# Altium project TMDX654GPEVM.PrjPcb (part 19 of 24)

## Sheet 40-PRE_REG AND SERDES POWER SUPPLY.SchDoc
size 513 x 386 mm
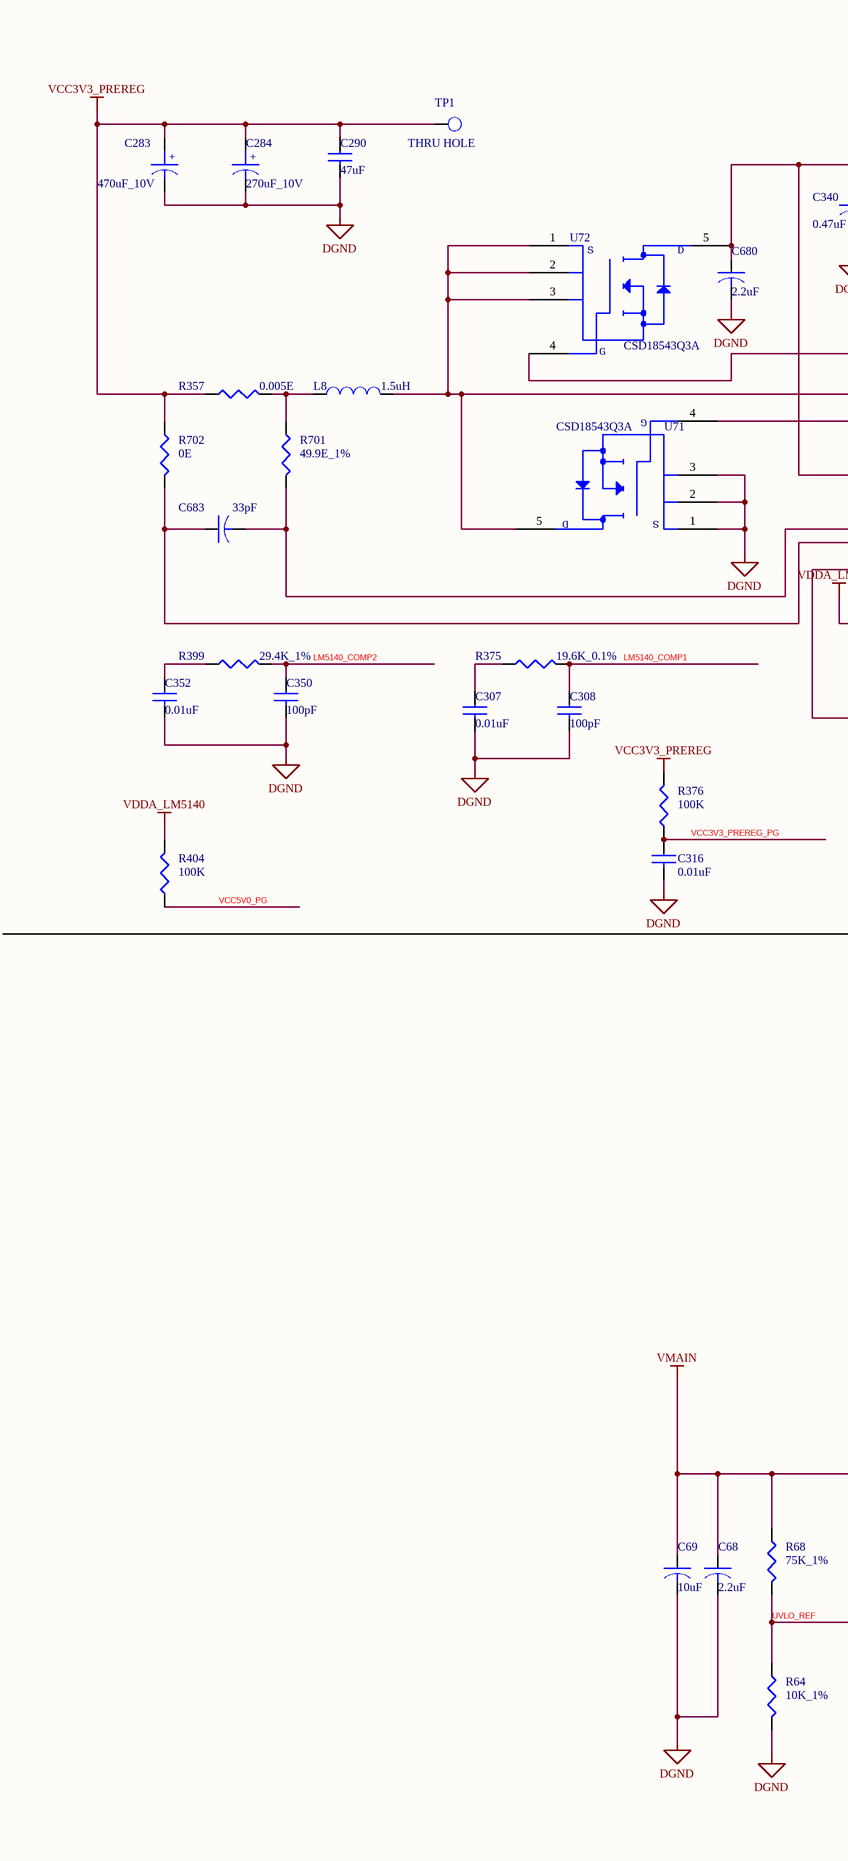
[diagram p74: 40-PRE_REG AND SERDES POWER SUPPLY.SchDoc, left]
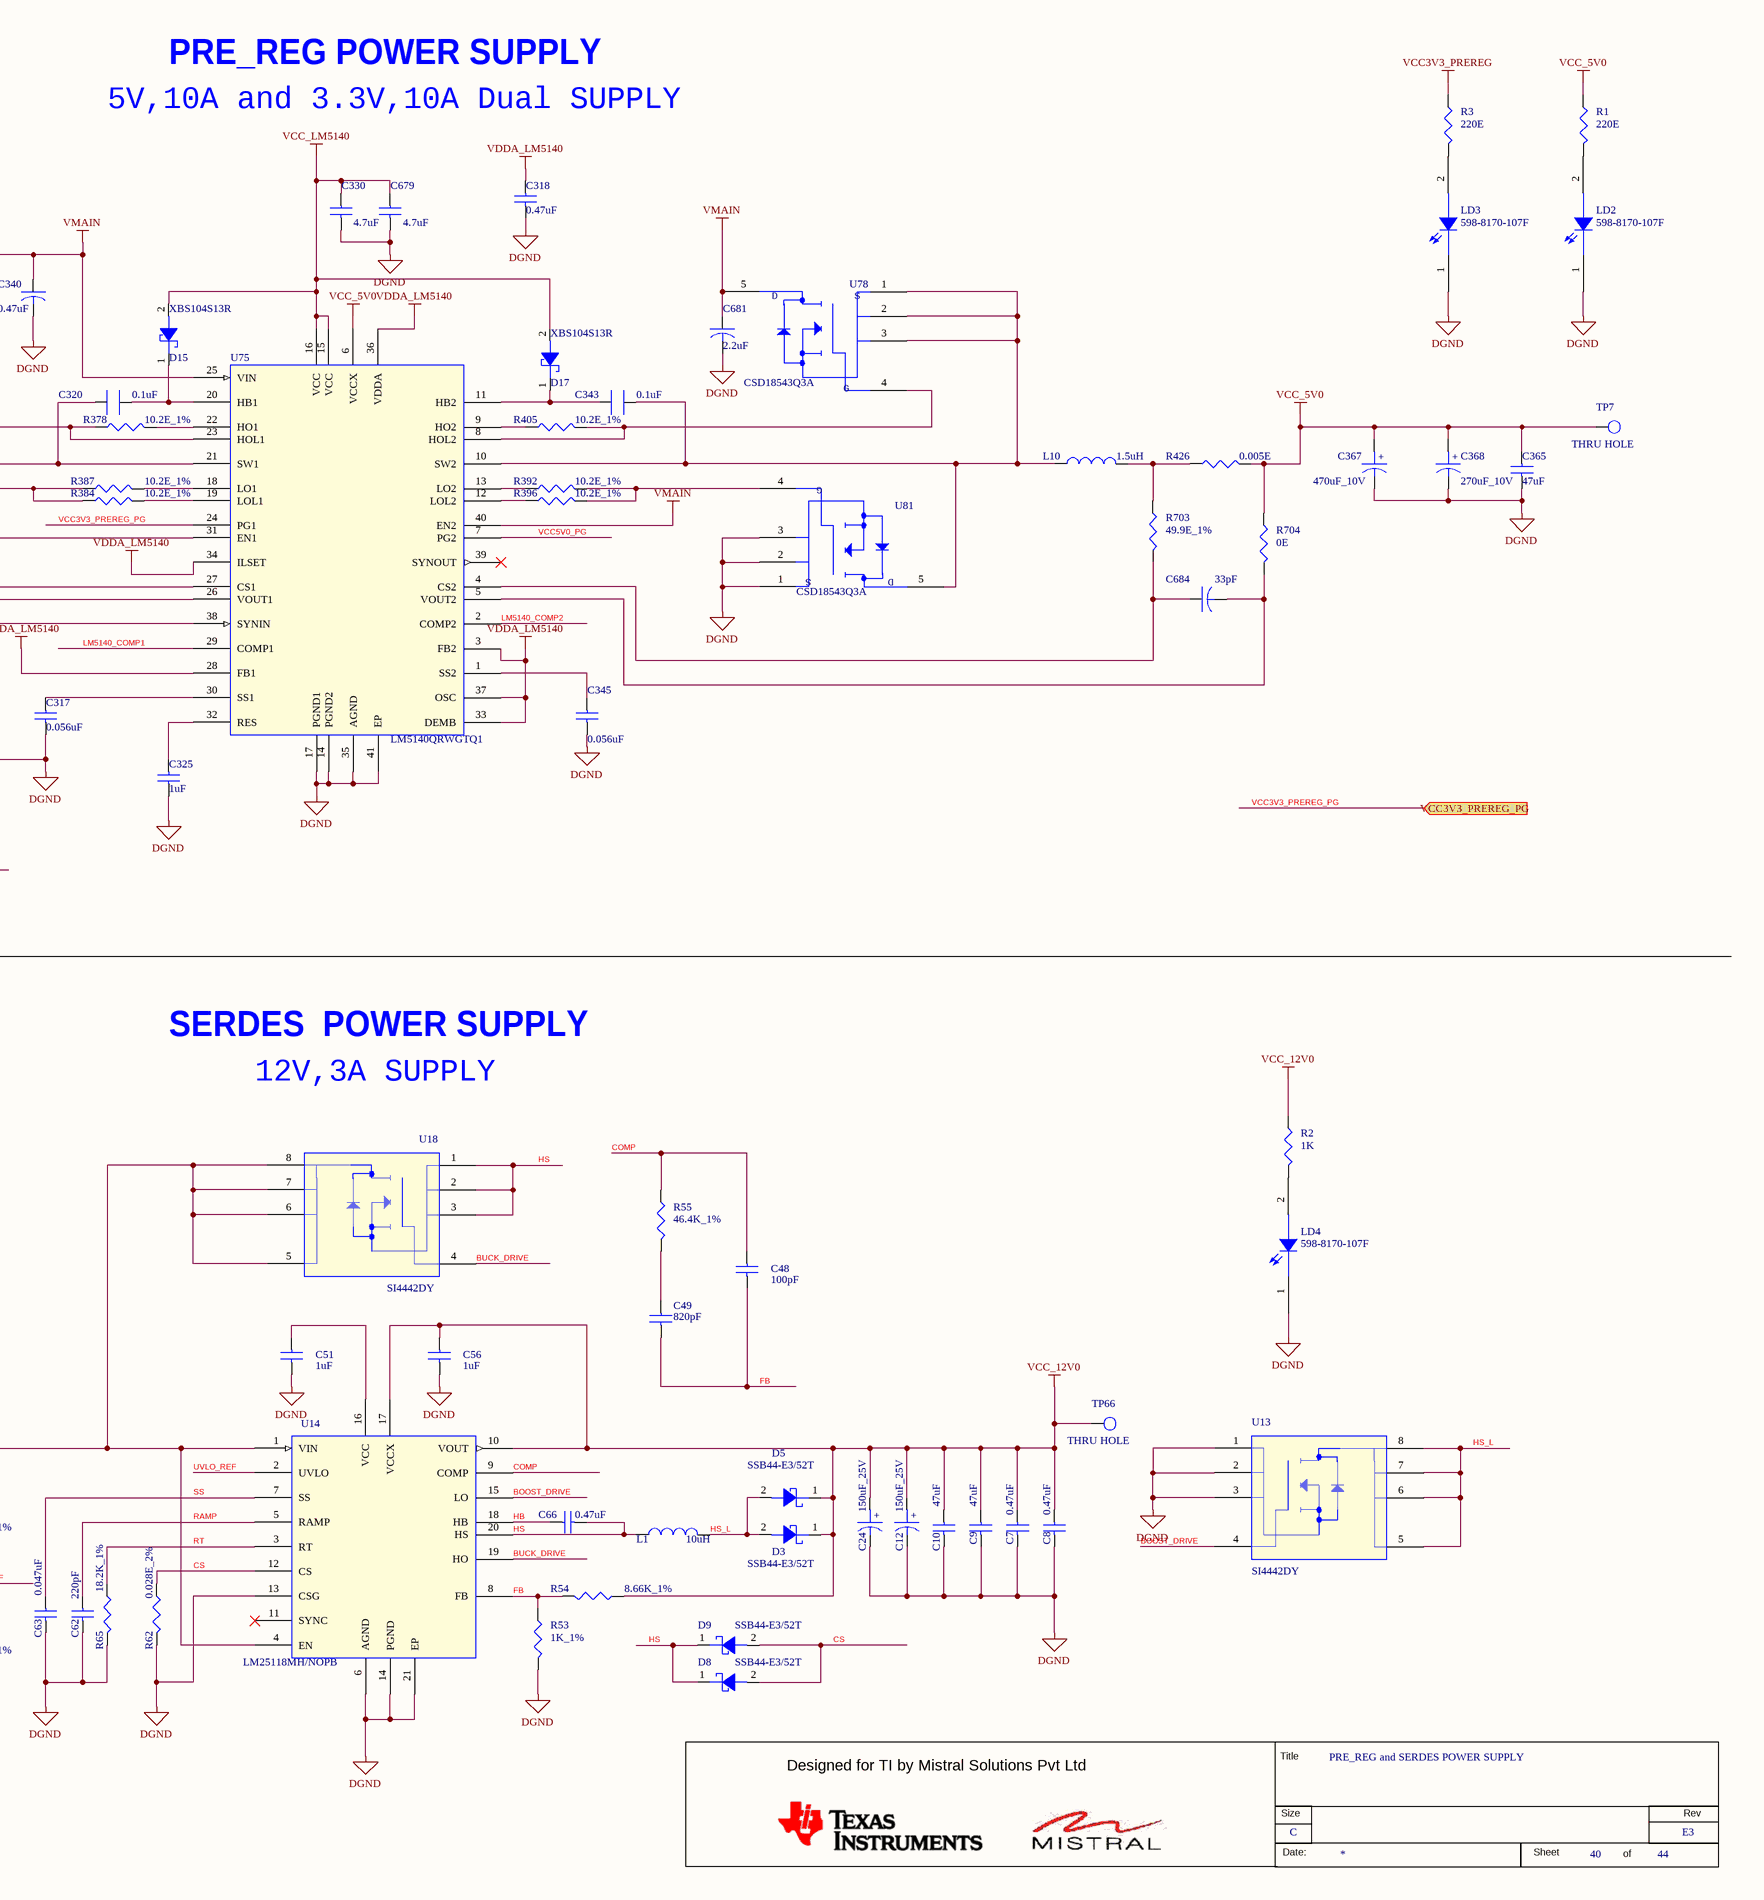
[diagram p75: 40-PRE_REG AND SERDES POWER SUPPLY.SchDoc, right]

### Parts
(Parts that share a designator on the sheet are numbered #1, #2 ... from top to bottom, then left to right.)
*#40  RevCode: E3  Title: PRE_REG and SERDES POWER SUPPLY  Page Size: C  Page Number: 40  Page Count: 44  (hidden comment: MISTRAL_TITLEBLK_CSIZE)  (graphical)
C7  0.47uF  [CAP0805_1]
C8  0.47uF  [CAP0805_1]
C9  47uF  [CAP1206_2]
C10  47uF  [CAP1206_2]
C12  150uF_25V  [CAPAE_CASE8383_11]
C24  150uF_25V  [CAPAE_CASE8383_11]
C48  100pF  [CAP0402]
C49  820pF  [CAP0402_0-75]
C51  1uF  [CAP0603_1]
C56  1uF  [CAP0603_1]
C62  220pF  [CAP0402]
C63  0.047uF  [CAP0402_0-75]
C66  0.47uF  [CAP0805_1]
C68  2.2uF  [CAP0805_1]
C69  10uF  [CAP1206_2]
C283  470uF_10V  [CAPAE_D8CASE_8]
C284  270uF_10V  [CAP_87510524_270X270_SMD_7-7]
C290  47uF  [CAP1206_2]
C307  0.01uF  [CAP0402_0-75]
C308  100pF  [CAP0402]
C316  0.01uF  [CAP0201_0-5]
C317  0.056uF  [CAP0402_0-75]
C318  0.47uF  [CAP0603_1]
C320  0.1uF  [CAP0201_0-5]
C325  1uF  [CAP0402_0-75]
C330  4.7uF  [CAP0402_0-75]
C340  0.47uF  [CAP0805_1-5]
C343  0.1uF  [CAP0201_0-5]
C345  0.056uF  [CAP0402_0-75]
C350  100pF  [CAP0402]
C352  0.01uF  [CAP0402_0-75]
C365  47uF  [CAP1206_2]
C367  470uF_10V  [CAPAE_D8CASE_8]
C368  270uF_10V  [CAP_87510524_270X270_SMD_7-7]
C679  4.7uF  [CAP0402_0-75]
C680  2.2uF  [CAP0805_1]
C681  2.2uF  [CAP0805_1]
C683  33pF  [CAP0201_0-5]
C684  33pF  [CAP0201_0-5]
D3  SSB44-E3/52T  [DIO_SMB_2-5]
D5  SSB44-E3/52T  [DIO_SMB_2-5]
D8  SSB44-E3/52T  [DIO_SMB_2-5]
D9  SSB44-E3/52T  [DIO_SMB_2-5]
D15  XBS104S13R  [DIO_SOD323_1]
D17  XBS104S13R  [DIO_SOD323_1]
L1  10uH  [IND_ETQP5MYFM_310X290_SMD_5-4]
L8  1.5uH  [IND_ETQP4MKVK_350X330_SMD_4]
L10  1.5uH  [IND_ETQP4MKVK_350X330_SMD_4]
LD2  598-8170-107F  [LED_0805_0-7]
LD3  598-8170-107F  [LED_0805_0-7]
LD4  598-8170-107F  [LED_0805_0-7]
R1  220E  [RES0402_0-5]
R2  1K  [RES0201]
R3  220E  [RES0402_0-5]
R53  1K_1%  [RES0402_0-5]
R54  8.66K_1%  [RES0402]
R55  46.4K_1%  [RES0402]
R62  0.028E_2%  [RES0815_0-75]
R64  10K_1%  [RES0402_0-5]
R65  18.2K_1%  [RES0402]
R68  75K_1%  [RES0402_0-5]
R357  0.005E  [RES1206]
R375  19.6K_0.1%  [RES0402]
R376  100K  [RES0402_0-5]
R378  10.2E_1%  [RES0402_0-5]
R384  10.2E_1%  [RES0402_0-5]
R387  10.2E_1%  [RES0402_0-5]
R392  10.2E_1%  [RES0402_0-5]
R396  10.2E_1%  [RES0402_0-5]
R399  29.4K_1%  [RES0402]
R404  100K  [RES0402_0-5]
R405  10.2E_1%  [RES0402_0-5]
R426  0.005E  [RES1206]
R701  49.9E_1%  [RES0201]
R702  0E  [RES0402_0-5]
R703  49.9E_1%  [RES0201]
R704  0E  [RES0402_0-5]
TP1  THRU HOLE  [TP_40X65]
TP7  THRU HOLE  [TP_40X65]
TP66  THRU HOLE  [TP_40X65]
U13  SI4442DY  [SOIC8_1-8]
U14  LM25118MH/NOPB  [ETSSOP20_25-59_260X180_1-1]
U18  SI4442DY  [SOIC8_1-8]
U71  CSD18543Q3A  [VSONP8_CSD18543Q_120X130_0-9]
U72  CSD18543Q3A  [VSONP8_CSD18543Q_120X130_0-9]
U75  LM5140QRWGTQ1  [QFN40_19-68_240X240_0-9]
U78  CSD18543Q3A  [VSONP8_CSD18543Q_120X130_0-9]
U81  CSD18543Q3A  [VSONP8_CSD18543Q_120X130_0-9]

### Ports
VCC3V3_PREREG_PG (in)

### Nets
DGND: C7.2 C8.2 C9.2 C10.2 C12.2 C24.2 C51.2 C56.2 C62.2 C63.2 C68.2 C69.2 C283.2 C284.2 C290.2 C307.2 C308.2 C316.2 C317.2 C318.2 C325.1 C330.2 C340.2 C345.2 C350.2 C352.2 C365.2 C367.2 C368.2 C679.2 C680.2 C681.2 LD2.1 LD3.1 LD4.1 R53.2 R62.2 R64.2 R65.2 U13.1(S1) U13.2(S2) U13.3(S3) U14.6(AGND) U14.13(CSG) U14.14(PGND) U14.21(EP) U71.1(S1) U71.2(S2) U71.3(S3) U75.14(PGND2) U75.17(PGND1) U75.35(AGND) U75.38(SYNIN) U75.41(EP) U81.1(S1) U81.2(S2) U81.3(S3)
VCC3V3_PREREG: C283.1 C284.1 C290.1 R3.1 R357.1 R376.2 R702.1 TP1.1(TP)
VCC_5V0: C365.1 C367.1 C368.1 R1.1 R426.2 R704.1 TP7.1(TP) U75.6(VCCX)
VCC_12V0: C7.1 C8.1 C9.1 C10.1 C12.1 C24.1 C56.1 D3.1(CATHODE) D5.1(CATHODE) R2.1 R54.1 TP66.1(TP) U14.10(VOUT) U14.17(VCCX)
VCC_LM5140: C330.1 C679.1 D15.2(ANODE) D17.2(ANODE) U75.15(VCC) U75.16(VCC)
VDDA_LM5140: C318.1 R404.2 U75.3(FB2) U75.28(FB1) U75.33(DEMB) U75.34(ILSET) U75.36(VDDA) U75.37(OSC)
VMAIN: C68.1 C69.1 C340.1 C680.1 C681.1 R68.1 U14.1(VIN) U14.4(EN) U18.5(D1) U18.6(D2) U18.7(D3) U18.8(D4) U72.5(D) U75.25(VIN) U75.31(EN1) U75.40(EN2) U78.5(D)
BOOST_DRIVE: U13.4(G) U14.15(LO)
BUCK_DRIVE: U14.19(HO) U18.4(G)
COMP: C48.1 R55.1 U14.9(COMP)
CS: D8.2(ANODE) D9.2(ANODE) R62.1 U14.12(CS)
FB: C48.2 C49.2 R53.1 R54.2 U14.8(FB)
HB: C66.1 U14.18(HB)
HS: C66.2 D8.1(CATHODE) D9.1(CATHODE) L1.1 U14.20(HS) U18.1(S1) U18.2(S2) U18.3(S3)
HS_L: D3.2(ANODE) D5.2(ANODE) L1.2 U13.5(D1) U13.6(D2) U13.7(D3) U13.8(D4)
LM5140_COMP1: C308.1 R375.2 U75.29(COMP1)
LM5140_COMP2: C350.1 R399.2 U75.2(COMP2)
RAMP: C62.1 U14.5(RAMP)
RT: R65.1 U14.3(RT)
SS: C63.1 U14.7(SS)
UVLO_REF: R64.1 R68.2 U14.2(UVLO)
VCC3V3_PREREG_PG: C316.1 R376.1 U75.24(PG1) ; port VCC3V3_PREREG_PG
VCC5V0_PG: R404.1 U75.7(PG2)
NetC49_1: C49.1 R55.2
NetC51_1: C51.1 U14.16(VCC)
NetC307_1: C307.1 R375.1
NetC317_1: C317.1 U75.30(SS1)
NetC320_1: C320.1 D15.1(CATHODE) U75.20(HB1)
NetC320_2: C320.2 L8.2 U71.5(D) U72.1(S1) U72.2(S2) U72.3(S3) U75.21(SW1)
NetC325_2: C325.2 U75.32(RES)
NetC343_1: C343.1 L10.1 U75.10(SW2) U78.1(S1) U78.2(S2) U78.3(S3) U81.5(D)
NetC343_2: C343.2 D17.1(CATHODE) U75.11(HB2)
NetC345_1: C345.1 U75.1(SS2)
NetC352_1: C352.1 R399.1
NetC683_1: C683.1 R702.2 U75.26(VOUT1)
NetC683_2: C683.2 R701.2 U75.27(CS1)
NetC684_1: C684.1 R703.2 U75.4(CS2)
NetC684_2: C684.2 R704.2 U75.5(VOUT2)
NetL8_1: L8.1 R357.2 R701.1
NetL10_2: L10.2 R426.1 R703.1
NetLD2_2: LD2.2 R1.2
NetLD3_2: LD3.2 R3.2
NetLD4_2: LD4.2 R2.2
NetR378_1: R378.1 U72.4(G) U75.23(HOL1)
NetR378_2: R378.2 U75.22(HO1)
NetR384_1: R384.1 R387.1 U71.4(G)
NetR384_2: R384.2 U75.19(LOL1)
NetR387_2: R387.2 U75.18(LO1)
NetR392_1: R392.1 U75.13(LO2)
NetR392_2: R392.2 R396.2 U81.4(G)
NetR396_1: R396.1 U75.12(LOL2)
NetR405_1: R405.1 U75.9(HO2)
NetR405_2: R405.2 U75.8(HOL2) U78.4(G)

Not connected (* = marked no-connect by the designer): U14 11(SYNC)*; U75 39(SYNOUT)*

### Notes on the sheet
- 5V,10A and 3.3V,10A Dual SUPPLY
- PRE_REG POWER SUPPLY
- SERDES  POWER SUPPLY
- 12V,3A SUPPLY
- (in symbol CAP_POL) +
- (in symbol MISTRAL_TITLEBLK_CSIZE) Title; Designed for TI by Mistral Solutions Pvt Ltd; Size; Rev; Date:; Sheet; of
- (in symbol MOSFET_CSD18501Q5A) S

### Library data of the parts
*#40 = MISTRAL_TITLEBLK_CSIZE: Issue: 1.0; Page Create Date: March  8, 1995; Page Modify Date: *
C7 C8 C66 = CAP_Dup5: CAP CERAMIC 0.47uF 25V 10% X5R 0805; Part_type: CAPACITORS\CERAMIC; Mfr_part_number: TMK212BJ474KD-T; Mfr_name: TAIYO YUDEN; Mistral Part No: 120018010009-R; Wattage: NA; Custom_Duty: 15%; Customs_HS_Code: 85322990; Project: TI_MAXIE_CPB; PCB Footprint: CAP0805_1; MECHANICAL 3D STEP FILE: CAP0805_1; Temperature: -55°C+85°C; Weight: 5.5mg; Chkd/date: MANIRAJA/120218; Crtd /date: MANIRAJA/120218; Datasheet: Y:\MIS_DATABASE\DATASHEETS\CAPACITORS\TMK212BJ474KD.PDF; Height: 0.95MM; Distributor_part_number: 587-1290-1-ND; Distributor_name: DIGIKEY; Package: 0805; Voltage: 25V; Tolerance: 10%; Library Ref: CAP
C9 = CAP_Dup5: CAP CERAMIC 47uF 25V 20% X5R 1206; Part_type: CAPACITORS\CERAMIC; Mfr_part_number: GRM31CR61E476ME44L; Mfr_name: MURATA; Mistral Part No: 120013050002-R; Custom_Duty: 15%; Customs_HS_Code: 85322990; Wattage: NA; Project: TI_MAXIE_CPB; PCB Footprint: CAP1206_2; MECHANICAL 3D STEP FILE: CAP1206_2; Chkd/date: MANIRAJA/230118; Crtd /date: MANIRAJA/230118; Datasheet: Y:\MIS_DATABASE\DATASHEETS\CAPACITORS\GRM31.PDF; Temperature: -55°C+85°C; Weight: NA; Height: 1.80MM; Distributor_part_number: 490-16268-1-ND; Distributor_name: DIGIKEY; Package: 1206; Voltage: 25V; Tolerance: 20%; Library Ref: CAP
C10 C290 C365 = CAP_Dup5: CAP CERAMIC 47uF 25V 20% X5R 1206; Mistral Part No: 120013050002-R; Mfr_name: MURATA; Mfr_part_number: GRM31CR61E476ME44L; Part_type: CAPACITORS\CERAMIC; Project: TI_MAXIE_CPB; Wattage: NA; Customs_HS_Code: 85322990; Custom_Duty: 15%; PCB Footprint: CAP1206_2; Tolerance: 20%; Voltage: 25V; Package: 1206; Distributor_name: DIGIKEY; Distributor_part_number: 490-16268-1-ND; Height: 1.80MM; Weight: NA; Temperature: -55°C+85°C; Datasheet: Y:\MIS_DATABASE\DATASHEETS\CAPACITORS\GRM31.PDF; Crtd /date: MANIRAJA/230118; Chkd/date: MANIRAJA/230118; MECHANICAL 3D STEP FILE: CAP1206_2; Library Ref: CAP
C12 C24 = CAP_POL: CAP ELECTROLYTIC 150uF 25V 20% CASE_8383; Mistral Part No: 120018010023-R; Mfr_name: NICHICON; Mfr_part_number: UWT1E151MNL1GS; Part_type: CAPACITORS\ELECTROLYTIC; Project: TI_MAXIE_CPB; Customs_HS_Code: 85322990; Custom_Duty: 15%; Wattage: NA; PCB Footprint: CAPAE_CASE8383_11; Tolerance: 20%; Voltage: 25V; Package: CASE_8383; Distributor_name: DIGIKEY; Distributor_part_number: 493-2191-1-ND; Height: 10.80MM; Datasheet: Y:\MIS_DATABASE\DATASHEETS\CAPACITORS\UWT-SER.PDF; Crtd /date: MANIRAJA/240118; Chkd/date: MANIRAJA/240118; Weight: NA; Temperature: -55°C+105°C; MECHANICAL 3D STEP FILE: CAPAE_CASE8383_11; Library Ref: CAP_POL
C48 C350 = CAP_Dup5: CAP CERAMIC 100pF 50V 10% X7R 0402; Part_type: CAPACITORS\CERAMIC; Mfr_part_number: CC0402KRX7R9BB101; Mfr_name: YAGEO; Mistral Part No: 120014030006-R; Custom_Duty: 15%; Customs_HS_Code: 85322990; Wattage: NA; Project: DMP; PCB Footprint: CAP0402; Chkd/date: JAGADISH/110314; Crtd /date: SARANYA/110314; Datasheet: Y:\MIS_DATABASE\DATASHEETS\CAPACITORS\YACC0603.PDF; Temperature: -55°C+125°C; Weight: NA; Height: 0.55MM; Distributor_part_number: 311-1419-1-ND; Distributor_name: DIGIKEY; Package: 0402; Voltage: 50V; Tolerance: 10%; Library Ref: CAP
C49 = CAP_Dup5: CAP CERAMIC 820pF 50V 5% C0G(NP0) 0402; Part_type: CAPACITORS\CERAMIC; Mfr_part_number: C1005NP01H821J050BA; Mfr_name: TDK CORPORATION; Mistral Part No: 120018010010-R; Custom_Duty: 15%; Customs_HS_Code: 85322990; Wattage: NA; Project: TI_MAXIE_CPB; MECHANICAL 3D STEP FILE: CAP0402_0-75; PCB Footprint: CAP0402_0-75; Chkd/date: MANIRAJA/120218; Crtd /date: MANIRAJA/120218; Datasheet: Y:\MIS_DATABASE\DATASHEETS\CAPACITORS\C1005NP01H821J050BA.PDF; Temperature: -55°C+150°C; Weight: 0.65mg; Height: 0.55MM; Distributor_part_number: 445-13812-1-ND; Distributor_name: DIGIKEY; Package: 0402; Voltage: 50V; Tolerance: 5%; Library Ref: CAP
C51 C56 = CAP_Dup5: CAP CERAMIC 1uF 25V 10% X5R 0603; Mistral Part No: 120010080040-R; Mfr_name: AVX CORPORATION; Mfr_part_number: 06033D105KAT2A; Part_type: CAPACITORS\CERAMIC; Project: TI_MAXIE_CPB; Wattage: NA; Customs_HS_Code: 85322990; Custom_Duty: 15%; MECHANICAL 3D STEP FILE: CAP0603_1; PCB Footprint: CAP0603_1; Tolerance: 10%; Voltage: 25V; Package: 0603; Distributor_name: DIGIKEY; Distributor_part_number: 478-5142-1-ND; Height: 0.94MM; Weight: 2mg; Temperature: -55°C+85°C; Datasheet: Y:\MIS_DATABASE\DATASHEETS\CAPACITORS\AVX_MLC.PDF; Crtd /date: MANIRAJA/230118; Chkd/date: MANIRAJA/230118; Library Ref: CAP
C62 = CAP_Dup5: CAP CERAMIC 220pF 25V 5% C0G 0402; Mistral Part No: 120015120016-R; Mfr_name: MURATA; Mfr_part_number: GRM1555C1E221JA01D; Part_type: CAPACITORS\CERAMIC; Project: DLRL_NBSDR; Wattage: NA; Customs_HS_Code: 85322990; Custom_Duty: 15%; PCB Footprint: CAP0402; Tolerance: 5%; Voltage: 25V; Package: 0402; Distributor_name: DIGIKEY; Distributor_part_number: 490-8174-1-ND; Height: 0.55MM; Weight: NA; Temperature: -55°C+125°C; Datasheet: Y:\MIS_DATABASE\DATASHEETS\CAPACITORS\GRM188SERIES.PDF; Crtd /date: VASANTHA/211215; Chkd/date: VASANTHA/211215; Library Ref: CAP
C63 = CAP_Dup5: CAP CERAMIC 0.047uF 50V 10% X7R 0402; Part_type: CAPACITORS\CERAMIC; Mfr_part_number: GRM155R71H473KE14J; Mfr_name: MURATA; Mistral Part No: 120018010011-R; Custom_Duty: 15%; Customs_HS_Code: 85322990; Wattage: NA; Project: TI_MAXIE_CPB; MECHANICAL 3D STEP FILE: CAP0402_0-75; Chkd/date: MANIRAJA/240118; Crtd /date: MANIRAJA/240118; Datasheet: Y:\MIS_DATABASE\DATASHEETS\CAPACITORS\GRM155R71H473KE14.PDF; Temperature: -55°C+125°C; Weight: 6mg; Height: 0.55MM; Distributor_part_number: GRM155R71H473KE14J-ND; Distributor_name: DIGIKEY; Package: 0402; Voltage: 50V; Tolerance: 10%; PCB Footprint: CAP0402_0-75; Library Ref: CAP
C68 = CAP: CAP CERAMIC 2.2uF 50V 10% X5R 0805; Mistral Part No: 120018010012-R; Mfr_name: TDK CORPORATION; Mfr_part_number: C2012X5R1H225K085AB; Part_type: CAPACITORS\CERAMIC; Project: TI_MAXIE_CPB; Wattage: NA; Customs_HS_Code: 85322990; Custom_Duty: 15%; Footprint Path: Y:\MIS_DATABASE\Library\ALTIUM_TOOL\PCB_FOOTPRINTS\Altium_Footprint_Lib.PcbLib; Library Path: Y:\MIS_DATABASE\Library\ALTIUM_TOOL\SCHEMATICS_PARTS\MS_DISCRETE_Library.schlib; Footprint Ref: CAP0805_1; PCB Footprint: CAP0805_1; Tolerance: 10%; Voltage: 50V; Package: 0805; Distributor_name: DIGIKEY; Distributor_part_number: 445-14407-1-ND; Height: 1.00MM; Weight: 5.5mg; Temperature: -55°C+85°C; Datasheet: Y:\MIS_DATABASE\DATASHEETS\CAPACITORS\TDK_C-SER-JUL17.PDF; Crtd /date: MANIRAJA/310818; Chkd/date: MANIRAJA/310818; MECHANICAL 3D STEP FILE: CAP0805_1; Library Ref: CAP
C69 = CAP: CAP CERAMIC 10uF 50V 20% X5R 1206; Mistral Part No: 120018010013-R; Mfr_name: MURATA; Mfr_part_number: GRM31CR61H106MA12L; Part_type: CAPACITORS\CERAMIC; Project: TI_MAXIE_CPB; Wattage: NA; Customs_HS_Code: 85322990; Custom_Duty: 15%; Footprint Path: Y:\MIS_DATABASE\Library\ALTIUM_TOOL\PCB_FOOTPRINTS\Altium_Footprint_Lib.PcbLib; Library Path: Y:\MIS_DATABASE\Library\ALTIUM_TOOL\SCHEMATICS_PARTS\MS_DISCRETE_Library.schlib; MECHANICAL 3D STEP FILE: CAP1206_2; PCB Footprint: CAP1206_2; Tolerance: 20%; Voltage: 50V; Package: 1206; Distributor_name: DIGIKEY; Distributor_part_number: 490-10756-1-ND; Height: 1.80MM; Weight: 40mg; Temperature: -55°C+85°C; Datasheet: Y:\MIS_DATABASE\DATASHEETS\CAPACITORS\GRM31CR61H106MA12.PDF; Crtd /date: MANIRAJA/240118; Chkd/date: MANIRAJA/240118; Library Ref: CAP; Footprint Ref: CAP1206_2
C283 C367 = CAP_POL: CAP ELECTROLYTIC 470uF 10V 20% D8CASE_6666; Part_type: CAPACITORS\ELECTROLYTIC; Mfr_part_number: EEE-FTA471XAP; Mfr_name: PANASONIC; Mistral Part No: 120017100008-R; Custom_Duty: 15%; Customs_HS_Code: 85322990; Wattage: NA; Project: TI_MAXIE_CPB; PCB Footprint: CAPAE_D8CASE_8; MECHANICAL 3D STEP FILE: CAPAE_D8CASE_8; Chkd/date: MANIRAJA/171017; Crtd /date: MANIRAJA/171017; Datasheet: Y:\MIS_DATABASE\DATASHEETS\CAPACITORS\FTV-SER.PDF; Temperature: -55°C+105°C; Weight: NA; Height: 8.00MM; Distributor_part_number: P15094CT-ND; Distributor_name: DIGIKEY; Package: D8CASE_6666; Voltage: 10V; Tolerance: 20%; Library Ref: CAP_POL
C284 = CAP_POL: CAP POLMER 270uF 10V 20% SMD; Mistral Part No: 120018010024-R; Mfr_name: WURTH ELECTRONICS; Mfr_part_number: 875105245014; Part_type: CAPACITORS\POLYPROPYLENE; Project: TI_MAXIE_CPB; Wattage: NA; Customs_HS_Code: 85322990; Custom_Duty: 15%; PCB Footprint: CAP_87510524_270X270_SMD_7-7; Tolerance: 20%; Voltage: 10V; Package: SMD; Distributor_name: DIGIKEY; Distributor_part_number: 732-6414-1-ND; Height: 7.7MM; Weight: NA; Temperature: -55°C+105°C; Datasheet: Y:\MIS_DATABASE\DATASHEETS\CAPACITORS\875105245014.PDF; Crtd /date: MANIRAJA/240118; Chkd/date: MANIRAJA/240118; MECHANICAL 3D STEP FILE: CAP_87510524_270X270_SMD_7-7; Library Ref: CAP_POL
C307 C352 = CAP_Dup5: CAP CERAMIC 0.01uF 10V 10% X7R 0402; Mistral Part No: 120009030017-R; Mfr_name: AVX CORPORATION; Mfr_part_number: 0402ZC103KAT2A; Part_type: CAPACITORS\CERAMIC; Project: ADR; Wattage: NA; Customs_HS_Code: 85322990; Custom_Duty: 15%; PCB Footprint: CAP0402_0-75; Tolerance: 10%; Voltage: 10V; Package: 0402; Distributor_name: DIGIKEY; Distributor_part_number: 478-7890-1-ND; Height: 0.56MM; Weight: 0.65mg; Temperature: -55°C+125°C; Datasheet: Y:\MIS_DATABASE\DATASHEETS\CAPACITORS\AVX_MLC.PDF; Crtd /date: MAZHAR/201005; Chkd/date: VASANTHA/061216; MECHANICAL 3D STEP FILE: CAP0402_0-75; Library Ref: CAP
C308 = CAP_Dup5: CAP CERAMIC 100pF 50V 10% X7R 0402; Mistral Part No: 120014030006-R; Mfr_name: YAGEO; Mfr_part_number: CC0402KRX7R9BB101; Part_type: CAPACITORS\CERAMIC; Project: DMP; Wattage: NA; Customs_HS_Code: 85322990; Custom_Duty: 15%; PCB Footprint: CAP0402; Tolerance: 10%; Voltage: 50V; Package: 0402; Distributor_name: DIGIKEY; Distributor_part_number: 311-1419-1-ND; Height: 0.55MM; Weight: NA; Temperature: -55°C+125°C; Datasheet: Y:\MIS_DATABASE\DATASHEETS\CAPACITORS\YACC0603.PDF; Crtd /date: SARANYA/110314; Chkd/date: JAGADISH/110314; Library Ref: CAP
C316 = CAP_Dup5: CAP CERAMIC 0.01uF 25V 10% X5R 0201; Part_type: CAPACITORS\CERAMIC; Mfr_part_number: GRM033R61E103KA12J; Mfr_name: MURATA; Mistral Part No: 120018010007-R; Custom_Duty: 15%; Customs_HS_Code: 85322990; Project: TI_MAXIE_CPB; Wattage: NA; PCB Footprint: CAP0201_0-5; Chkd/date: MANIRAJA/230118; Crtd /date: MANIRAJA/230118; Datasheet: Y:\MIS_DATABASE\DATASHEETS\CAPACITORS\GRM033R61E103KA12.PDF; Height: 0.33MM; Distributor_part_number: GRM033R61E103KA12J-ND; Distributor_name: DIGIKEY; Package: 0201; Voltage: 25V; Tolerance: 10%; Weight: 0.33mg; Temperature: -55°C+85°C; MECHANICAL 3D STEP FILE: CAP0201_0-5; Library Ref: CAP
C317 = CAP_Dup5: CAP CERAMIC 0.056uF 10V 10% X5R 0402; Part_type: CAPACITORS\CERAMIC; Mfr_part_number: GRM155R61A563KA01D; Mfr_name: MURATA; Mistral Part No: 120018010014-R; Custom_Duty: 15%; Customs_HS_Code: 85322990; Wattage: NA; Project: TI_MAXIE_CPB; MECHANICAL 3D STEP FILE: CAP0402_0-75; PCB Footprint: CAP0402_0-75; Chkd/date: MANIRAJA/240118; Crtd /date: MANIRAJA/240118; Datasheet: Y:\MIS_DATABASE\DATASHEETS\CAPACITORS\GRM155R61A563KA01.PDF; Temperature: -55°C+85°C; Weight: 6mg; Height: 0.55MM; Distributor_part_number: 490-5413-1-ND; Distributor_name: DIGIKEY; Package: 0402; Voltage: 10V; Tolerance: 10%; Library Ref: CAP
C318 = CAP_Dup5: CAP CERAMIC 0.47uF 25V 10% X7R 0603; Mistral Part No: 120009030111-R; Mfr_name: YAGEO AMERICA; Mfr_part_number: CC0603KRX7R8BB474; Part_type: CAPACITORS\CERAMIC; Project: TI_MAXIE_CPB; Wattage: NA; Customs_HS_Code: 85322990; Custom_Duty: 15%; Tolerance: 10%; Voltage: 25V; Package: 0603; Distributor_name: DIGIKEY; Distributor_part_number: 311-1805-1-ND; Height: 0.87MM; Weight: 2mg; Temperature: -55°C+125°C; Datasheet: Y:\MIS_DATABASE\DATASHEETS\CAPACITORS\YACC0603.PDF; Crtd /date: MANIRAJA/240118; Chkd/date: MANIRAJA/240118; MECHANICAL 3D STEP FILE: CAP0603_1; PCB Footprint: CAP0603_1; Library Ref: CAP
C320 = CAP_Dup3: CAP CERAMIC 0.1uF 16V 10% X5R 0201; Mistral Part No: 120009030072-R; Mfr_name: MURATA; Mfr_part_number: GRM033R61C104KE84J; Part_type: CAPACITORS\CERAMIC; Project: TI_MAXIE_CPB; Customs_HS_Code: 85322990; Custom_Duty: 15%; Wattage: NA; PCB Footprint: CAP0201_0-5; Tolerance: 10%; Voltage: 16V; Package: 0201; Distributor_name: DIGIKEY; Distributor_part_number: 490-16742-1-ND; Height: 0.33MM; Datasheet: Y:\MIS_DATABASE\DATASHEETS\CAPACITORS\GRM033R61C104KE84.PDF; Crtd /date: MANIRAJA/120218; Chkd/date: MANIRAJA/120218; Weight: 0.33mg; Temperature: -55°C+85°C; MECHANICAL 3D STEP FILE: CAP0201_0-5; Library Ref: CAP
C325 = CAP_Dup5: as C169 on sheet 36-ETHERNET PHY CLOCK GENERATOR; Tolerance: 20%; Voltage: 16V; Package: 0402; Distributor_name: DIGIKEY; Distributor_part_number: 587-5514-1-ND; Height: 0.55MM; Weight: 0.65mg; Temperature: -55°C+85°C; Datasheet: Y:\MIS_DATABASE\DATASHEETS\CAPACITORS\EMK105BJ105MV-F.PDF; Crtd /date: ALVY/150218; Chkd/date: MANIRAJA/150218; PCB Footprint: CAP0402_0-75; MECHANICAL 3D STEP FILE: CAP0402_0-75; Library Path: Y:\MIS_DATABASE\Library\ALTIUM_TOOL\SCHEMATICS_PARTS\MS_DISCRETE_Library.schlib; Footprint Path: Y:\MIS_DATABASE\Library\ALTIUM_TOOL\PCB_FOOTPRINTS\Altium_Footprint_Lib.PcbLib; Library Ref: CAP; Footprint Ref: CAP0402_0-75
C330 = CAP_Dup5: CAP CERAMIC 4.7uF 10V 20% X5R 0402; Part_type: CAPACITORS\CERAMIC; Mfr_part_number: 0402ZD475MAT2A; Mfr_name: AVX CORPORATION; Mistral Part No: 120012060002-R; Custom_Duty: 15%; Customs_HS_Code: 85322990; Wattage: NA; Project: TI_MAXIE_CPB; MECHANICAL 3D STEP FILE: CAP0402_0-75; Chkd/date: MANIRAJA/230118; Crtd /date: MANIRAJA/230118; Datasheet: Y:\MIS_DATABASE\DATASHEETS\CAPACITORS\AVX_MLC.PDF; Temperature: -55°C+85°C; Weight: 0.65mg; Height: 0.71MM; Distributor_part_number: 478-10791-1-ND; Distributor_name: DIGIKEY; Package: 0402; Voltage: 10V; Tolerance: 20%; PCB Footprint: CAP0402_0-75; Library Ref: CAP
C340 = CAP: CAP CERAMIC 0.47uF 50V 5% X7R 0805; Mistral Part No: 120018010019-R; Mfr_name: YAGEO AMERICA; Mfr_part_number: CC0805JKX7R9BB474; Part_type: CAPACITORS\CERAMIC; Project: TI_MAXIE_CPB; Wattage: NA; Customs_HS_Code: 85322990; Custom_Duty: 15%; MECHANICAL 3D STEP FILE: CAP0805_1-5; PCB Footprint: CAP0805_1-5; Tolerance: 5%; Voltage: 50V; Package: 0805; Distributor_name: MOUSER; Distributor_part_number: 603-CC0805JK7R9BB474; Height: 1.35MM; Weight: 5.5mg; Temperature: -55°C+125°C; Datasheet: Y:\MIS_DATABASE\DATASHEETS\CAPACITORS\YACC0603.PDF; Crtd /date: MANIRAJA/240118; Chkd/date: MANIRAJA/240118; Library Ref: CAP
C343 = CAP_Dup3: CAP CERAMIC 0.1uF 16V 10% X5R 0201; Part_type: CAPACITORS\CERAMIC; Mfr_part_number: GRM033R61C104KE84J; Mfr_name: MURATA; Mistral Part No: 120009030072-R; Wattage: NA; Custom_Duty: 15%; Customs_HS_Code: 85322990; Project: TI_MAXIE_CPB; PCB Footprint: CAP0201_0-5; MECHANICAL 3D STEP FILE: CAP0201_0-5; Temperature: -55°C+85°C; Weight: 0.33mg; Chkd/date: MANIRAJA/120218; Crtd /date: MANIRAJA/120218; Datasheet: Y:\MIS_DATABASE\DATASHEETS\CAPACITORS\GRM033R61C104KE84.PDF; Height: 0.33MM; Distributor_part_number: 490-16742-1-ND; Distributor_name: DIGIKEY; Package: 0201; Voltage: 16V; Tolerance: 10%; Library Ref: CAP
C345 = CAP_Dup5: CAP CERAMIC 0.056uF 10V 10% X5R 0402; Mistral Part No: 120018010014-R; Mfr_name: MURATA; Mfr_part_number: GRM155R61A563KA01D; Part_type: CAPACITORS\CERAMIC; Project: TI_MAXIE_CPB; Wattage: NA; Customs_HS_Code: 85322990; Custom_Duty: 15%; MECHANICAL 3D STEP FILE: CAP0402_0-75; PCB Footprint: CAP0402_0-75; Tolerance: 10%; Voltage: 10V; Package: 0402; Distributor_name: DIGIKEY; Distributor_part_number: 490-5413-1-ND; Height: 0.55MM; Weight: 6mg; Temperature: -55°C+85°C; Datasheet: Y:\MIS_DATABASE\DATASHEETS\CAPACITORS\GRM155R61A563KA01.PDF; Crtd /date: MANIRAJA/240118; Chkd/date: MANIRAJA/240118; Library Ref: CAP
C368 = CAP_POL: CAP POLMER 270uF 10V 20% SMD; Part_type: CAPACITORS\POLYPROPYLENE; Mfr_part_number: 875105245014; Mfr_name: WURTH ELECTRONICS; Mistral Part No: 120018010024-R; Custom_Duty: 15%; Customs_HS_Code: 85322990; Wattage: NA; Project: TI_MAXIE_CPB; PCB Footprint: CAP_87510524_270X270_SMD_7-7; MECHANICAL 3D STEP FILE: CAP_87510524_270X270_SMD_7-7; Chkd/date: MANIRAJA/240118; Crtd /date: MANIRAJA/240118; Datasheet: Y:\MIS_DATABASE\DATASHEETS\CAPACITORS\875105245014.PDF; Temperature: -55°C+105°C; Weight: NA; Height: 7.7MM; Distributor_part_number: 732-6414-1-ND; Distributor_name: DIGIKEY; Package: SMD; Voltage: 10V; Tolerance: 20%; Library Ref: CAP_POL
C679 = CAP_Dup5: CAP CERAMIC 4.7uF 10V 20% X5R 0402; Mistral Part No: 120012060002-R; Mfr_name: AVX CORPORATION; Mfr_part_number: 0402ZD475MAT2A; Part_type: CAPACITORS\CERAMIC; Project: TI_MAXIE_CPB; Wattage: NA; Customs_HS_Code: 85322990; Custom_Duty: 15%; Tolerance: 20%; Voltage: 10V; Package: 0402; Distributor_name: DIGIKEY; Distributor_part_number: 478-10791-1-ND; Height: 0.71MM; Weight: 0.65mg; Temperature: -55°C+85°C; Datasheet: Y:\MIS_DATABASE\DATASHEETS\CAPACITORS\AVX_MLC.PDF; Crtd /date: MANIRAJA/230118; Chkd/date: MANIRAJA/230118; MECHANICAL 3D STEP FILE: CAP0402_0-75; PCB Footprint: CAP0402_0-75; Library Ref: CAP
C680 C681 = CAP: CAP CERAMIC 2.2uF 50V 10% X5R 0805; Part_type: CAPACITORS\CERAMIC; Mfr_part_number: C2012X5R1H225K085AB; Mfr_name: TDK CORPORATION; Mistral Part No: 120018010012-R; Custom_Duty: 15%; Customs_HS_Code: 85322990; Wattage: NA; Project: TI_MAXIE_CPB; Footprint Path: Y:\MIS_DATABASE\Library\ALTIUM_TOOL\PCB_FOOTPRINTS\Altium_Footprint_Lib.PcbLib; Library Path: Y:\MIS_DATABASE\Library\ALTIUM_TOOL\SCHEMATICS_PARTS\MS_DISCRETE_Library.schlib; Footprint Ref: CAP0805_1; PCB Footprint: CAP0805_1; MECHANICAL 3D STEP FILE: CAP0805_1; Chkd/date: MANIRAJA/310818; Crtd /date: MANIRAJA/310818; Datasheet: Y:\MIS_DATABASE\DATASHEETS\CAPACITORS\TDK_C-SER-JUL17.PDF; Temperature: -55°C+85°C; Weight: 5.5mg; Height: 1.00MM; Distributor_part_number: 445-14407-1-ND; Distributor_name: DIGIKEY; Package: 0805; Voltage: 50V; Tolerance: 10%; Library Ref: CAP
C683 = CAP: CAP CERAMIC 33pF 50V 2% C0G(NP0) 0201; Mistral Part No: 120018010015-R; Mfr_name: MURATA; Mfr_part_number: GRM0335C1H330GA01D; Part_type: CAPACITORS\CERAMIC; Wattage: NA; Project: TI_MAXIE_CPB; Customs_HS_Code: 85322990; Custom_Duty: 15%; MECHANICAL 3D STEP FILE: CAP0201_0-5; Temperature: -55°C+125°C; Weight: 0.33mg; PCB Footprint: CAP0201_0-5; Tolerance: 2%; Voltage: 50V; Package: 0201; Distributor_name: DIGIKEY; Distributor_part_number: 490-11325-1-ND; Height: 0.33MM; Datasheet: Y:\MIS_DATABASE\DATASHEETS\CAPACITORS\GRM0335C1H330GA01.PDF; Crtd /date: MANIRAJA/240118; Chkd/date: MANIRAJA/240118; Library Ref: CAP
C684 = CAP: CAP CERAMIC 33pF 50V 2% C0G(NP0) 0201; Part_type: CAPACITORS\CERAMIC; Mfr_part_number: GRM0335C1H330GA01D; Mfr_name: MURATA; Mistral Part No: 120018010015-R; Wattage: NA; Custom_Duty: 15%; Customs_HS_Code: 85322990; Project: TI_MAXIE_CPB; MECHANICAL 3D STEP FILE: CAP0201_0-5; Temperature: -55°C+125°C; Weight: 0.33mg; PCB Footprint: CAP0201_0-5; Chkd/date: MANIRAJA/240118; Crtd /date: MANIRAJA/240118; Datasheet: Y:\MIS_DATABASE\DATASHEETS\CAPACITORS\GRM0335C1H330GA01.PDF; Height: 0.33MM; Distributor_part_number: 490-11325-1-ND; Distributor_name: DIGIKEY; Package: 0201; Voltage: 50V; Tolerance: 2%; Library Ref: CAP
D3 = DIODE_SCHOTTKY: DIODE SCHOTTKY RECTIFIER 40V 4A DO-214AA(SMB); Part_type: DIODE\SCHOTTKY; Mfr_name: VISHAY; Mistral Part No: 130017100021-R; Custom_Duty: 15%; Customs_HS_Code: 85412900; Wattage: NA; Project: TI_MAXIE_CPB; MECHANICAL 3D STEP FILE: DIO_SMB_2-5; PCB Footprint: DIO_SMB_2-5; Chkd/date: MANIRAJA/171017; Crtd /date: MANIRAJA/171017; Datasheet: Y:\MIS_DATABASE\DATASHEETS\DISCRETES\DIODES\SSB4XX.PDF; Temperature: -65°C+150°C; Weight: 180mg; Height: 2.44MM; Distributor_part_number: SSB44-E3/52TGICT-ND; Distributor_name: DIGIKEY; Package: DO-214AA; Voltage: NA; Tolerance: NA; Mfr_part_number: SSB44-E3/52T; Library Ref: DIODE_SCHOTTKY
D5 D8 D9 = DIODE_SCHOTTKY: DIODE SCHOTTKY RECTIFIER 40V 4A DO-214AA(SMB); Mistral Part No: 130017100021-R; Mfr_name: VISHAY; Part_type: DIODE\SCHOTTKY; Project: TI_MAXIE_CPB; Tolerance: NA; Customs_HS_Code: 85412900; Custom_Duty: 15%; MECHANICAL 3D STEP FILE: DIO_SMB_2-5; PCB Footprint: DIO_SMB_2-5; Mfr_part_number: SSB44-E3/52T; Voltage: NA; Wattage: NA; Package: DO-214AA; Distributor_name: DIGIKEY; Distributor_part_number: SSB44-E3/52TGICT-ND; Height: 2.44MM; Weight: 180mg; Temperature: -65°C+150°C; Datasheet: Y:\MIS_DATABASE\DATASHEETS\DISCRETES\DIODES\SSB4XX.PDF; Crtd /date: MANIRAJA/171017; Chkd/date: MANIRAJA/171017; Library Ref: DIODE_SCHOTTKY
D15 = DIODE_SCHOTTKY: DIODE SCHOTTKY 40V 1A SOD323A; Part_type: DIODE\SCHOTTKY; Mfr_part_number: XBS104S13R-G; Mfr_name: TOREX; Mistral Part No: 130018020038-R; Custom_Duty: 24%; Customs_HS_Code: 85437099; Wattage: NA; Project: TI_MAXIE_CPB; MECHANICAL 3D STEP FILE: DIO_SOD323_1; Chkd/date: MANIRAJA/150218; Crtd /date: ALVY/150218; Datasheet: Y:\MIS_DATABASE\DATASHEETS\DISCRETES\DIODES\XBS104S13R-G.PDF; Temperature: NA; Weight: NA; Height: 1.00MM; Distributor_part_number: 893-1188-1-ND; Distributor_name: DIGIKEY; Package: SOD323; Voltage: 40V; Tolerance: NA; PCB Footprint: DIO_SOD323_1; Library Path: Y:\MIS_DATABASE\Library\ALTIUM_TOOL\SCHEMATICS_PARTS\MS_DISCRETE_Library.schlib; Footprint Path: Y:\MIS_DATABASE\Library\ALTIUM_TOOL\PCB_FOOTPRINTS\Altium_Footprint_Lib.PcbLib; Library Ref: DIODE_SCHOTTKY; Footprint Ref: DIO_SOD323_1
D17 = DIODE_SCHOTTKY: DIODE SCHOTTKY 40V 1A SOD323A; Mistral Part No: 130018020038-R; Mfr_name: TOREX; Mfr_part_number: XBS104S13R-G; Part_type: DIODE\SCHOTTKY; Project: TI_MAXIE_CPB; Tolerance: NA; Customs_HS_Code: 85437099; Custom_Duty: 24%; Voltage: 40V; Wattage: NA; Package: SOD323; Distributor_name: DIGIKEY; Distributor_part_number: 893-1188-1-ND; Height: 1.00MM; Weight: NA; Temperature: NA; Datasheet: Y:\MIS_DATABASE\DATASHEETS\DISCRETES\DIODES\XBS104S13R-G.PDF; Crtd /date: ALVY/150218; Chkd/date: MANIRAJA/150218; MECHANICAL 3D STEP FILE: DIO_SOD323_1; PCB Footprint: DIO_SOD323_1; Library Path: Y:\MIS_DATABASE\Library\ALTIUM_TOOL\SCHEMATICS_PARTS\MS_DISCRETE_Library.schlib; Footprint Path: Y:\MIS_DATABASE\Library\ALTIUM_TOOL\PCB_FOOTPRINTS\Altium_Footprint_Lib.PcbLib; Library Ref: DIODE_SCHOTTKY; Footprint Ref: DIO_SOD323_1
L1 = INDUCTOR: IND POWER 10uH 5.7A 20% SMD; Mfr_part_number: ETQ-P5M100YFM; Mfr_name: PANASONIC; Mistral Part No: 130017100020-R; Wattage: NA; Custom_Duty: 24%; Customs_HS_Code: 85437099; Project: TI_MAXIE_CPB; MECHANICAL 3D STEP FILE: IND_ETQP5MYFM_310X290_SMD_5-4; Temperature: -40°C+150°C; Weight: NA; PCB Footprint: IND_ETQP5MYFM_310X290_SMD_5-4; Voltage: NA; Chkd/date: MANIRAJA/171017; Crtd /date: MANIRAJA/171017; Datasheet: Y:\MIS_DATABASE\DATASHEETS\DISCRETES\INDUCTORS\ETQ-P5XX-SER.PDF; Height: 5.40MM; Distributor_part_number: P17067CT-ND; Distributor_name: DIGIKEY; Package: SMD; Tolerance: 20%; Part_type: INDUCTOR; Library Ref: INDUCTOR
L8 = INDUCTOR: IND POWER 1.5uH 15.1A 20% SMD; Mistral Part No: 130017100018-R; Mfr_name: PANASONIC; Mfr_part_number: ETQ-P4M1R5KVK; Project: TI_MAXIE_CPB; Voltage: NA; Customs_HS_Code: 85437099; Custom_Duty: 24%; PCB Footprint: IND_ETQP4MKVK_350X330_SMD_4; Part_type: INDUCTOR; Tolerance: 20%; Wattage: NA; Package: SMD; Distributor_name: DIGIKEY; Distributor_part_number: PCD2466CT-ND; Height: 4.00MM; Weight: NA; Temperature: -55°C+155°C; Datasheet: Y:\MIS_DATABASE\DATASHEETS\DISCRETES\INDUCTORS\ETQPXX-SER.PDF; Crtd /date: MANIRAJA/171017; Chkd/date: MANIRAJA/171017; MECHANICAL 3D STEP FILE: IND_ETQP4MKVK_350X330_SMD_4; Library Ref: INDUCTOR
L10 = INDUCTOR: IND POWER 1.5uH 15.1A 20% SMD; Mfr_part_number: ETQ-P4M1R5KVK; Mfr_name: PANASONIC; Mistral Part No: 130017100018-R; Custom_Duty: 24%; Customs_HS_Code: 85437099; Wattage: NA; Project: TI_MAXIE_CPB; PCB Footprint: IND_ETQP4MKVK_350X330_SMD_4; MECHANICAL 3D STEP FILE: IND_ETQP4MKVK_350X330_SMD_4; Chkd/date: MANIRAJA/171017; Crtd /date: MANIRAJA/171017; Datasheet: Y:\MIS_DATABASE\DATASHEETS\DISCRETES\INDUCTORS\ETQPXX-SER.PDF; Temperature: -55°C+155°C; Weight: NA; Height: 4.00MM; Distributor_part_number: PCD2466CT-ND; Distributor_name: DIGIKEY; Package: SMD; Voltage: NA; Tolerance: 20%; Part_type: INDUCTOR; Library Ref: INDUCTOR
LD2-LD4 = LED_598-8170-107F: as LD10 on sheet 37-ETHERNET LEDs; PCB Footprint: LED_0805_0-7; MECHANICAL 3D STEP FILE: LED_0805_0-7; Chkd/date: MANIRAJA/230817; Crtd /date: SARANYA/070514; Datasheet: Y:\MIS_DATABASE\DATASHEETS\DISCRETES\LEDS\598-SER.PDF; Temperature: -30°C+85°C; Weight: NA; Height: 0.70MM; Distributor_part_number: 350-2044-1-ND; Distributor_name: DIGIKEY; Package: 0805; Voltage: NA; Tolerance: NA; Mfr_part_number: 598-8170-107F; Library Ref: LED_598-8170-107F
R1 R3 = RESISTOR_Dup5: RES 220E 1/16W 5% 0402; Part_type: RESISTORS\FIXED; Mfr_part_number: ERJ-2GEJ221X; Mfr_name: PANASONIC-ECG; Mistral Part No: 110009030506-R; Voltage: NA; Custom_Duty: 15%; Customs_HS_Code: 85332119; Project: RED EYE; Footprint Path: Y:\MIS_DATABASE\Library\ALTIUM_TOOL\PCB_FOOTPRINTS\Altium_Footprint_Lib.PcbLib; Library Path: Y:\MIS_DATABASE\Library\ALTIUM_TOOL\SCHEMATICS_PARTS\MS_DISCRETE_Library.schlib; MECHANICAL 3D STEP FILE: RES0402_0-5; Temperature: -55°C+155°C; Weight: 0.8g/1000pcs; PCB Footprint: RES0402_0-5; Chkd/date: VASANTHA/291216; Crtd /date: GEETHA/260406; Datasheet: Y:\MIS_DATABASE\DATASHEETS\RESISTORS\ERJ12.PDF; Height: 0.40MM; Distributor_part_number: P220JCT-ND; Distributor_name: DIGIKEY; Package: 0402; Wattage: 1/16W; Tolerance: 5%; Library Ref: RESISTOR
R2 = RESISTOR_Dup5: as R172 on sheet 36-ETHERNET PHY CLOCK GENERATOR; Tolerance: 5%; Wattage: 1/20W; Package: 0201; Distributor_name: DIGIKEY; Distributor_part_number: 541-1.00KAABCT-ND; Height: 0.28MM; Weight: NA; Temperature: -55°C+155°C; Datasheet: Y:\MIS_DATABASE\DATASHEETS\RESISTORS\CRCW0201.PDF; Crtd /date: JEBRAN/110815; Chkd/date: JEBRAN/110815; PCB Footprint: RES0201; Library Ref: RESISTOR
R53 = RESISTOR_Dup5: RES 1K 1/10W 1% 0402; Mistral Part No: 110009030411-R; Mfr_name: PANASONIC-ECG; Mfr_part_number: ERJ-2RKF1001X; Part_type: RESISTORS\FIXED; Cust_part_number: 4700-80039E; Project: VOCERA; Voltage: NA; Customs_HS_Code: 85332119; Custom_Duty: 15%; PCB Footprint: RES0402_0-5; Tolerance: 1%; Wattage: 1/10W; Package: 0402; Distributor_name: DIGIKEY; Distributor_part_number: P1.00KLCT-ND; Height: 0.40MM; Weight: 0.8g/1000pcs; Temperature: -55°C+125°C; Datasheet: Y:\MIS_DATABASE\DATASHEETS\RESISTORS\ERJ-2R.PDF; Crtd /date: MAZHAR/150506; Chkd/date: VASANTHA/281216; MECHANICAL 3D STEP FILE: RES0402_0-5; Library Path: Y:\MIS_DATABASE\Library\ALTIUM_TOOL\SCHEMATICS_PARTS\MS_DISCRETE_Library.schlib; Footprint Path: Y:\MIS_DATABASE\Library\ALTIUM_TOOL\PCB_FOOTPRINTS\Altium_Footprint_Lib.PcbLib; Library Ref: RESISTOR; Footprint Ref: RES0402_0-5
R54 = RESISTOR_Dup5: RES 8.66K 1/10W 1% 0402; Mistral Part No: 110012090010-R; Mfr_name: PANASONIC; Mfr_part_number: ERJ-2RKF8661X; Part_type: RESISTORS\FIXED; Project: ICP; Voltage: NA; Customs_HS_Code: 85332119; Custom_Duty: 15%; PCB Footprint: RES0402; Tolerance: 1%; Wattage: 1/10W; Package: 0402; Distributor_name: DIGIKEY; Distributor_part_number: P8.66KLCT-ND; Height: 0.40MM; Weight: 0.8/1000g; Temperature: -55°C+155°C; Datasheet: Y:\MIS_DATABASE\DATASHEETS\RESISTORS\ERJ-2R.PDF; Crtd /date: CHAITHANYA/260912; Chkd/date: JEBRAN/260315; Library Ref: RESISTOR
R55 = RESISTOR_Dup5: RES 46.4K 1/16W 1% 0402; Part_type: RESISTORS\FIXED; Mfr_part_number: CRCW040246K4FKED; Mfr_name: VISHAY; Mistral Part No: 110013020001-R; Custom_Duty: 15%; Customs_HS_Code: 85332119; Voltage: NA; Project: ITS-SCP; PCB Footprint: RES0402; Chkd/date: USMAN/230413; Crtd /date: USMAN/180213; Datasheet: Y:\MIS_DATABASE\DATASHEETS\RESISTORS\CRCW0603.PDF; Temperature: -55°C+155°C; Weight: 0.65mg; Height: 0.40MM; Distributor_part_number: 541-46.4KLCT-ND; Distributor_name: DIGIKEY; Package: 0402; Wattage: 1/16W; Tolerance: 1%; Library Ref: RESISTOR; Footprint Ref: RES0402; Library Path: Y:\MIS_DATABASE\Library\ALTIUM_TOOL\SCHEMATICS_PARTS\MS_DISCRETE_Library.schlib; Footprint Path: Y:\MIS_DATABASE\Library\ALTIUM_TOOL\PCB_FOOTPRINTS\Altium_Footprint_Lib.PcbLib
R62 = RESISTOR_Dup5: RES 0.028E 1W 2% 1508; Mistral Part No: 110017090012-R; Mfr_name: SUSUMU; Mfr_part_number: RL3720WT-R028-G; Part_type: RESISTORS\FIXED; Project: TI_MAXIE_CPB; Voltage: NA; Customs_HS_Code: 85332119; Custom_Duty: 15%; PCB Footprint: RES0815_0-75; Tolerance: 2%; Wattage: 1W; Package: 1508; Distributor_name: DIGIKEY; Distributor_part_number: 408-1717-1-ND; Height: 0.70MM; Weight: NA; Temperature: -55°C+125°C; Datasheet: Y:\MIS_DATABASE\DATASHEETS\RESISTORS\RL3720W-SER.PDF; Crtd /date: MANIRAJA/280917; Chkd/date: MANIRAJA/280917; MECHANICAL 3D STEP FILE: RES0815_0-75; Library Ref: RESISTOR
R64 = RESISTOR_Dup5: RES 10K 1/16W 1% 0402; Part_type: RESISTORS\FIXED; Mfr_part_number: RC0402FR-0710KL; Mfr_name: YAGEO AMERICA; Mistral Part No: 110009030220-P; Custom_Duty: 15%; Customs_HS_Code: 85332119; Voltage: NA; Project: VOCERA; RoHS: Pb-Free; Chkd/date: VASANTHA/201216; Crtd /date: GEETHA/290506; Datasheet: Y:\MIS_DATABASE\DATASHEETS\RESISTORS\YAGEO-RC0402.PDF; Temperature: -55°C+155°C; Weight: 0.65mg; Height: 0.40MM; Distributor_part_number: 311-10.0KLRTR-ND; Distributor_name: DIGIKEY; Package: 0402; Wattage: 1/16W; Tolerance: 1%; PCB Footprint: RES0402_0-5; MECHANICAL 3D STEP FILE: RES0402_0-5; Library Ref: RESISTOR; Footprint Ref: RES0402_0-5; Library Path: Y:\MIS_DATABASE\Library\ALTIUM_TOOL\SCHEMATICS_PARTS\MS_DISCRETE_Library.schlib; Footprint Path: Y:\MIS_DATABASE\Library\ALTIUM_TOOL\PCB_FOOTPRINTS\Altium_Footprint_Lib.PcbLib
R65 = RESISTOR_Dup5: RES 18.2K 1/16W 1% 0402; Mistral Part No: 110009031211-R; Mfr_name: PANASONIC-ECG; Mfr_part_number: ERJ-2RKF1822X; Part_type: RESISTORS\FIXED; Project: AXON; Customs_HS_Code: 85332119; Custom_Duty: 15%; PCB Footprint: RES0402; Tolerance: 1%; Wattage: 1/16W; Package: 0402; Distributor_name: DIGIKEY; Distributor_part_number: P18.2KLCT-ND; Height: 0.40MM; Datasheet: Y:\MIS_DATABASE\DATASHEETS\RESISTORS\PAN-ERJSERIES.PDF; Crtd /date: USMAN/130309; Chkd/date: MAZHAR/150709; Library Ref: RESISTOR
R68 = RESISTOR_Dup5: RES 75K 1/10W 1% 0402; Part_type: RESISTORS\FIXED; Mfr_part_number: ERJ-2RKF7502X; Mfr_name: PANASONIC-ECG; Mistral Part No: 110009031116-R; Voltage: NA; Custom_Duty: 15%; Customs_HS_Code: 85332119; Project: G4_SVGA; Footprint Path: Y:\MIS_DATABASE\Library\ALTIUM_TOOL\PCB_FOOTPRINTS\Altium_Footprint_Lib.PcbLib; Library Path: Y:\MIS_DATABASE\Library\ALTIUM_TOOL\SCHEMATICS_PARTS\MS_DISCRETE_Library.schlib; MECHANICAL 3D STEP FILE: RES0402_0-5; Temperature: -55°C+155°C; Weight: 0.8mg; PCB Footprint: RES0402_0-5; Chkd/date: MANIRAJA/040418; Crtd /date: MAZHAR/120505; Datasheet: Y:\MIS_DATABASE\DATASHEETS\RESISTORS\PAN-ERJSERIES.PDF; Height: 0.40MM; Distributor_part_number: P75.0KLCT-ND; Distributor_name: DIGIKEY; Package: 0402; Wattage: 1/10W; Tolerance: 1%; Library Ref: RESISTOR; Footprint Ref: RES0402_0-5
R357 R426 = RESISTOR_Dup5: RES 0.005E 1/2W 1% 1206; Mistral Part No: 110009030043-P; Mfr_name: VISHAY; Mfr_part_number: WSL12065L000FEA18; Part_type: RESISTORS\FIXED; Project: MDI; Customs_HS_Code: 85332119; Custom_Duty: 15%; PCB Footprint: RES1206; Tolerance: 1%; Wattage: 1/2W; Package: 1206; Distributor_name: DIGIKEY; Distributor_part_number: WSLD-.005CT-ND; Height: 0.89MM; Weight: 16.2g/1000pcs; Temperature: -65°C+170°C; Datasheet: Y:\MIS_DATABASE\DATASHEETS\RESISTORS\WSL-SERIES.PDF; Crtd /date: USMAN/190908; Chkd/date: SUHAS/290910; RoHS: Pb-Free; Library Ref: RESISTOR
R375 = RESISTOR_Dup5: RES 19.6K 1/16W 0.1% 0402; Mistral Part No: 110011100020-R; Mfr_name: VISHAY; Mfr_part_number: TNPW040219K6BEED; Part_type: RESISTORS\FIXED; Project: VP-4000-PROCESSOR; Voltage: NA; Customs_HS_Code: 85332119; Custom_Duty: 15%; PCB Footprint: RES0402; Tolerance: 0.1%; Wattage: 1/16W; Package: 0402; Distributor_name: DIGIKEY; Distributor_part_number: TNP19.6KDACT-ND; Height: 0.40MM; Weight: 0.65/1000g; Temperature: -55°C+125°C; Datasheet: Y:\MIS_DATABASE\DATASHEETS\RESISTORS\VISHAY_TNPW.PDF; Crtd /date: CHAITHANYA/121011; Chkd/date: BAVISH/131011; Library Ref: RESISTOR
R376 = RESISTOR_Dup5: RES 100K 1/16W 5% 0402; Mistral Part No: 110011060002-R; Mfr_name: VISHAY; Mfr_part_number: CRCW0402100KJNED; Part_type: RESISTORS\FIXED; Project: AM4515_EVM_LCD; Voltage: NA; Customs_HS_Code: 85332119; Custom_Duty: 15%; PCB Footprint: RES0402_0-5; Tolerance: 5%; Wattage: 1/16W; Package: 0402; Distributor_name: DIGIKEY; Distributor_part_number: 541-100KJCT-ND; Height: 0.40MM; Weight: 0.65mg; Temperature: -55°C+155°C; Datasheet: Y:\MIS_DATABASE\DATASHEETS\RESISTORS\CRCW0603.PDF; Crtd /date: BAVISH/010611; Chkd/date: VASANTHA/061216; MECHANICAL 3D STEP FILE: RES0402_0-5; Library Ref: RESISTOR
R378 R387 R396 R405 = RESISTOR_Dup5: RES 10.2E 1/16W 1% 0402; Part_type: RESISTORS\FIXED; Mfr_part_number: CRCW040210R2FKED; Mfr_name: VISHAY; Mistral Part No: 110017080001-R; Custom_Duty: 15%; Customs_HS_Code: 85332119; Voltage: NA; Project: TI_SVB_DUT; MECHANICAL 3D STEP FILE: RES0402_0-5; Chkd/date: MANIRAJA/030817; Crtd /date: MANIRAJA/030817; Datasheet: Y:\MIS_DATABASE\DATASHEETS\RESISTORS\CRCW0603.PDF; Temperature: -55°C+155°C; Weight: 0.65mg; Height: 0.40MM; Distributor_part_number: 541-10.2LCT-ND; Distributor_name: DIGIKEY; Package: 0402; Wattage: 1/16W; Tolerance: 1%; PCB Footprint: RES0402_0-5; Library Ref: RESISTOR
R384 R392 = RESISTOR_Dup5: RES 10.2E 1/16W 1% 0402; Mistral Part No: 110017080001-R; Mfr_name: VISHAY; Mfr_part_number: CRCW040210R2FKED; Part_type: RESISTORS\FIXED; Project: TI_SVB_DUT; Voltage: NA; Customs_HS_Code: 85332119; Custom_Duty: 15%; PCB Footprint: RES0402_0-5; Tolerance: 1%; Wattage: 1/16W; Package: 0402; Distributor_name: DIGIKEY; Distributor_part_number: 541-10.2LCT-ND; Height: 0.40MM; Weight: 0.65mg; Temperature: -55°C+155°C; Datasheet: Y:\MIS_DATABASE\DATASHEETS\RESISTORS\CRCW0603.PDF; Crtd /date: MANIRAJA/030817; Chkd/date: MANIRAJA/030817; MECHANICAL 3D STEP FILE: RES0402_0-5; Library Ref: RESISTOR
R399 = RESISTOR_Dup5: RES 29.4K 1/16W 1% 0402; Part_type: RESISTORS\FIXED; Mfr_part_number: ERJ-2RKF2942X; Mfr_name: PANASONIC-ECG; Mistral Part No: 110009030592-R; Custom_Duty: 15%; Customs_HS_Code: 85332119; Project: CTP02_REVA_BASE; PCB Footprint: RES0402; Chkd/date: SHREESHAIL/121205; Crtd /date: MAZHAR/120505; Datasheet: Y:\MIS_DATABASE\DATASHEETS\RESISTORS\PAN_ERJ.PDF; Height: 0.40MM; Distributor_part_number: P29.4KLTR-ND; Distributor_name: DIGIKEY; Package: 0402; Wattage: 1/16W; Tolerance: 1%; Library Ref: RESISTOR
R404 = RESISTOR_Dup5: RES 100K 1/16W 5% 0402; Part_type: RESISTORS\FIXED; Mfr_part_number: CRCW0402100KJNED; Mfr_name: VISHAY; Mistral Part No: 110011060002-R; Custom_Duty: 15%; Customs_HS_Code: 85332119; Voltage: NA; Project: AM4515_EVM_LCD; PCB Footprint: RES0402_0-5; MECHANICAL 3D STEP FILE: RES0402_0-5; Chkd/date: VASANTHA/061216; Crtd /date: BAVISH/010611; Datasheet: Y:\MIS_DATABASE\DATASHEETS\RESISTORS\CRCW0603.PDF; Temperature: -55°C+155°C; Weight: 0.65mg; Height: 0.40MM; Distributor_part_number: 541-100KJCT-ND; Distributor_name: DIGIKEY; Package: 0402; Wattage: 1/16W; Tolerance: 5%; Library Ref: RESISTOR
R701 = RESISTOR: RES 49.9E 1/20W 1% 0201; Mistral Part No: 110009030893-R; Mfr_name: PANASONIC-ECG; Mfr_part_number: ERJ-1GEF49R9C; Part_type: RESISTORS\FIXED; Project: V8TS; Customs_HS_Code: 85332119; Custom_Duty: 15%; Tolerance: 1%; Wattage: 1/20W; Package: 0201; Distributor_name: DIGIKEY; Distributor_part_number: P49.9ABCT-ND; Height: 0.26MM; Datasheet: Y:\MIS_DATABASE\DATASHEETS\RESISTORS\ERJ-1G.PDF; Crtd /date: MAZHAR/300807; Chkd/date: MAZHAR/140709; Library Path: Y:\MIS_DATABASE\Library\ALTIUM_TOOL\SCHEMATICS_PARTS\MS_DISCRETE_Library.schlib; Footprint Path: Y:\MIS_DATABASE\Library\ALTIUM_TOOL\PCB_FOOTPRINTS\Altium_Footprint_Lib.PcbLib; PCB Footprint: RES0201; Library Ref: RESISTOR
R702 R704 = RESISTOR: RES 0E 1/16W 0402; Mistral Part No: 110010080019-P; Mfr_name: VISHAY; Mfr_part_number: CRCW04020000Z0ED; Part_type: RESISTORS\FIXED; Project: PB_BUGBASE; Tolerance: NA; Customs_HS_Code: 85332119; Custom_Duty: 15%; Voltage: NA; Wattage: 1/16W; Package: 0402; Distributor_name: DIGIKEY; Distributor_part_number: 541-0.0JCT-ND; Height: 0.40MM; Weight: 0.65g/1000pcs; Temperature: -55°C+155°C; Datasheet: Y:\MIS_DATABASE\DATASHEETS\RESISTORS\CRCW0603.PDF; Crtd /date: MUDDU/190810; Chkd/date: VASANTHA/201216; RoHS: Pb-Free; MECHANICAL 3D STEP FILE: RES0402_0-5; PCB Footprint: RES0402_0-5; Library Ref: RESISTOR; Footprint Ref: RES0402_0-5; Library Path: Y:\MIS_DATABASE\Library\ALTIUM_TOOL\SCHEMATICS_PARTS\MS_DISCRETE_Library.schlib; Footprint Path: Y:\MIS_DATABASE\Library\ALTIUM_TOOL\PCB_FOOTPRINTS\Altium_Footprint_Lib.PcbLib
R703 = RESISTOR: RES 49.9E 1/20W 1% 0201; Part_type: RESISTORS\FIXED; Mfr_part_number: ERJ-1GEF49R9C; Mfr_name: PANASONIC-ECG; Mistral Part No: 110009030893-R; Custom_Duty: 15%; Customs_HS_Code: 85332119; Project: V8TS; Footprint Path: Y:\MIS_DATABASE\Library\ALTIUM_TOOL\PCB_FOOTPRINTS\Altium_Footprint_Lib.PcbLib; Library Path: Y:\MIS_DATABASE\Library\ALTIUM_TOOL\SCHEMATICS_PARTS\MS_DISCRETE_Library.schlib; Chkd/date: MAZHAR/140709; Crtd /date: MAZHAR/300807; Datasheet: Y:\MIS_DATABASE\DATASHEETS\RESISTORS\ERJ-1G.PDF; Height: 0.26MM; Distributor_part_number: P49.9ABCT-ND; Distributor_name: DIGIKEY; Package: 0201; Wattage: 1/20W; Tolerance: 1%; PCB Footprint: RES0201; Library Ref: RESISTOR
TP1 TP66 = TESTPOINT: TESTPOINT 1.0MM DRILL PTH; Part_type: MISC\TESTPOINT; Mfr_name: LOCAL; Mistral Part No: 130009030938; Project: HSE; NI_MARK: DNI; PCB Footprint: TP_40X65; Chkd/date: MAZHAR/271211; Crtd /date: SHREESHAIL/041005; Datasheet: NA; Height: NA; Distributor_part_number: NA; Distributor_name: NA; Package: THRU-HOLE; Mfr_part_number: TP_40X65; Library Ref: TESTPOINT
TP7 = TESTPOINT: TESTPOINT 1.0MM DRILL PTH; Mistral Part No: 130009030938; Mfr_name: LOCAL; Part_type: MISC\TESTPOINT; Project: HSE; NI_MARK: DNI; PCB Footprint: TP_40X65; Mfr_part_number: TP_40X65; Package: THRU-HOLE; Distributor_name: NA; Distributor_part_number: NA; Height: NA; Datasheet: NA; Crtd /date: SHREESHAIL/041005; Chkd/date: MAZHAR/271211; Library Ref: TESTPOINT
U13 U18 = MOSFET_SI4442DY: IC MOSFET N-CHANNEL 30V 15A SOIC8; Part_type: ICS\POWER\MOSFET; Mfr_name: VISHAY; Mistral Part No: 142009030189-R; Custom_Duty: 15%; Customs_HS_Code: 85423100; Wattage: NA; Project: KHAN_MAIN; PCB Footprint: SOIC8_1-8; MECHANICAL 3D STEP FILE: SOIC8_1-8; Chkd/date: MANIRAJA/130617; Crtd /date: USMAN/121208; Datasheet: Y:\MIS_DATABASE\DATASHEETS\DISCRETES\TRANSISTORS_FETS\SI4442DY.PDF; Temperature: -55°C+150°C; Weight: 85mg; Height: 1.75MM; Distributor_part_number: 781-SI4442DY; Distributor_name: MOUSER; Package: SOIC8; Voltage: NA; Tolerance: NA; Mfr_part_number: SI4442DY; Library Ref: MOSFET_SI4442DY
U14 = LM25118MH_HTSSOP20: IC WIDE VOLTAGE BUCK BOOST CONTROLLER HTSSOP20; Mistral Part No: 142017090017-R; Mfr_name: TEXAS INSTRUMENTS; Part_type: ICS\POWER\VOLTAGE REGULATOR; Project: TI_MAXIE_CPB; Tolerance: NA; Customs_HS_Code: 85423100; Custom_Duty: 15%; PCB Footprint: ETSSOP20_25-59_260X180_1-1; Mfr_part_number: LM25118MH/NOPB; Voltage: NA; Wattage: NA; Package: HTSSOP20; Distributor_name: DIGIKEY; Distributor_part_number: 296-38995-ND; Height: 1.10MM; Weight: 81.8mg; Temperature: -40°C+125°C; Datasheet: Y:\MIS_DATABASE\DATASHEETS\ICS\POWER\LM25118MH.PDF; Crtd /date: MANIRAJA/250917; Chkd/date: MANIRAJA/250917; MECHANICAL 3D STEP FILE: ETSSOP20_25-59_260X180_1-1; Library Ref: LM25118MH_HTSSOP20
U71 U72 U81 = MOSFET_CSD18501Q5A: IC MOSFET N-CHANNEL 60V VSONP8; Part_type: ICS\POWER\MOSFET; Mfr_name: TEXAS INSTRUMENTS; Mistral Part No: 142017100004-R; Custom_Duty: 15%; Customs_HS_Code: 85423100; Wattage: NA; Project: TI_MAXIE_CPB; PCB Footprint: VSONP8_CSD18543Q_120X130_0-9; MECHANICAL 3D STEP FILE: VSONP8_CSD18543Q_120X130_0-9; Chkd/date: MANIRAJA/041017; Crtd /date: MANIRAJA/041017; Datasheet: Y:\MIS_DATABASE\DATASHEETS\ICS\POWER\CSD18543Q3A.PDF; Temperature: -55°C+150°C; Weight: NA; Height: 0.90MM; Distributor_part_number: 296-47321-1-ND; Distributor_name: DIGIKEY; Package: VSONP8; Voltage: 60V; Tolerance: NA; Mfr_part_number: CSD18543Q3A; Library Ref: MOSFET_CSD18501Q5A
U75 = LM5140QRWGTQ1_VQFNP40: IC WIDE I/P DUAL SYNCHRONOUS BUCK CONTROLLER VQFNP40; Mistral Part No: 142017100003-R; Mfr_name: TEXAS INSTRUMENTS; Part_type: ICS\POWER\CONVERTER; Project: TI_MAXIE_CPB; Tolerance: NA; Customs_HS_Code: 85423100; Custom_Duty: 15%; PCB Footprint: QFN40_19-68_240X240_0-9; Mfr_part_number: LM5140QRWGTQ1; Voltage: NA; Wattage: NA; Package: VQFNP40; Distributor_name: DIGIKEY; Distributor_part_number: 296-43790-1-ND; Height: 0.90MM; Weight: 104mg; Temperature: -40°C+150°C; Datasheet: Y:\MIS_DATABASE\DATASHEETS\ICS\POWER\LM5140QRWGXX.PDF; Crtd /date: MANIRAJA/041017; Chkd/date: MANIRAJA/041017; MECHANICAL 3D STEP FILE: QFN40_19-68_240X240_0-9; Library Ref: LM5140QRWGTQ1_VQFNP40
U78 = MOSFET_CSD18501Q5A: IC MOSFET N-CHANNEL 60V VSONP8; Mistral Part No: 142017100004-R; Mfr_name: TEXAS INSTRUMENTS; Part_type: ICS\POWER\MOSFET; Project: TI_MAXIE_CPB; Tolerance: NA; Customs_HS_Code: 85423100; Custom_Duty: 15%; PCB Footprint: VSONP8_CSD18543Q_120X130_0-9; Mfr_part_number: CSD18543Q3A; Voltage: 60V; Wattage: NA; Package: VSONP8; Distributor_name: DIGIKEY; Distributor_part_number: 296-47321-1-ND; Height: 0.90MM; Weight: NA; Temperature: -55°C+150°C; Datasheet: Y:\MIS_DATABASE\DATASHEETS\ICS\POWER\CSD18543Q3A.PDF; Crtd /date: MANIRAJA/041017; Chkd/date: MANIRAJA/041017; MECHANICAL 3D STEP FILE: VSONP8_CSD18543Q_120X130_0-9; Library Ref: MOSFET_CSD18501Q5A